# EasyEDA Pro project JLCPRO-PCB-NFC_2023-07-24.epro

# Board PCB-NFC卡片
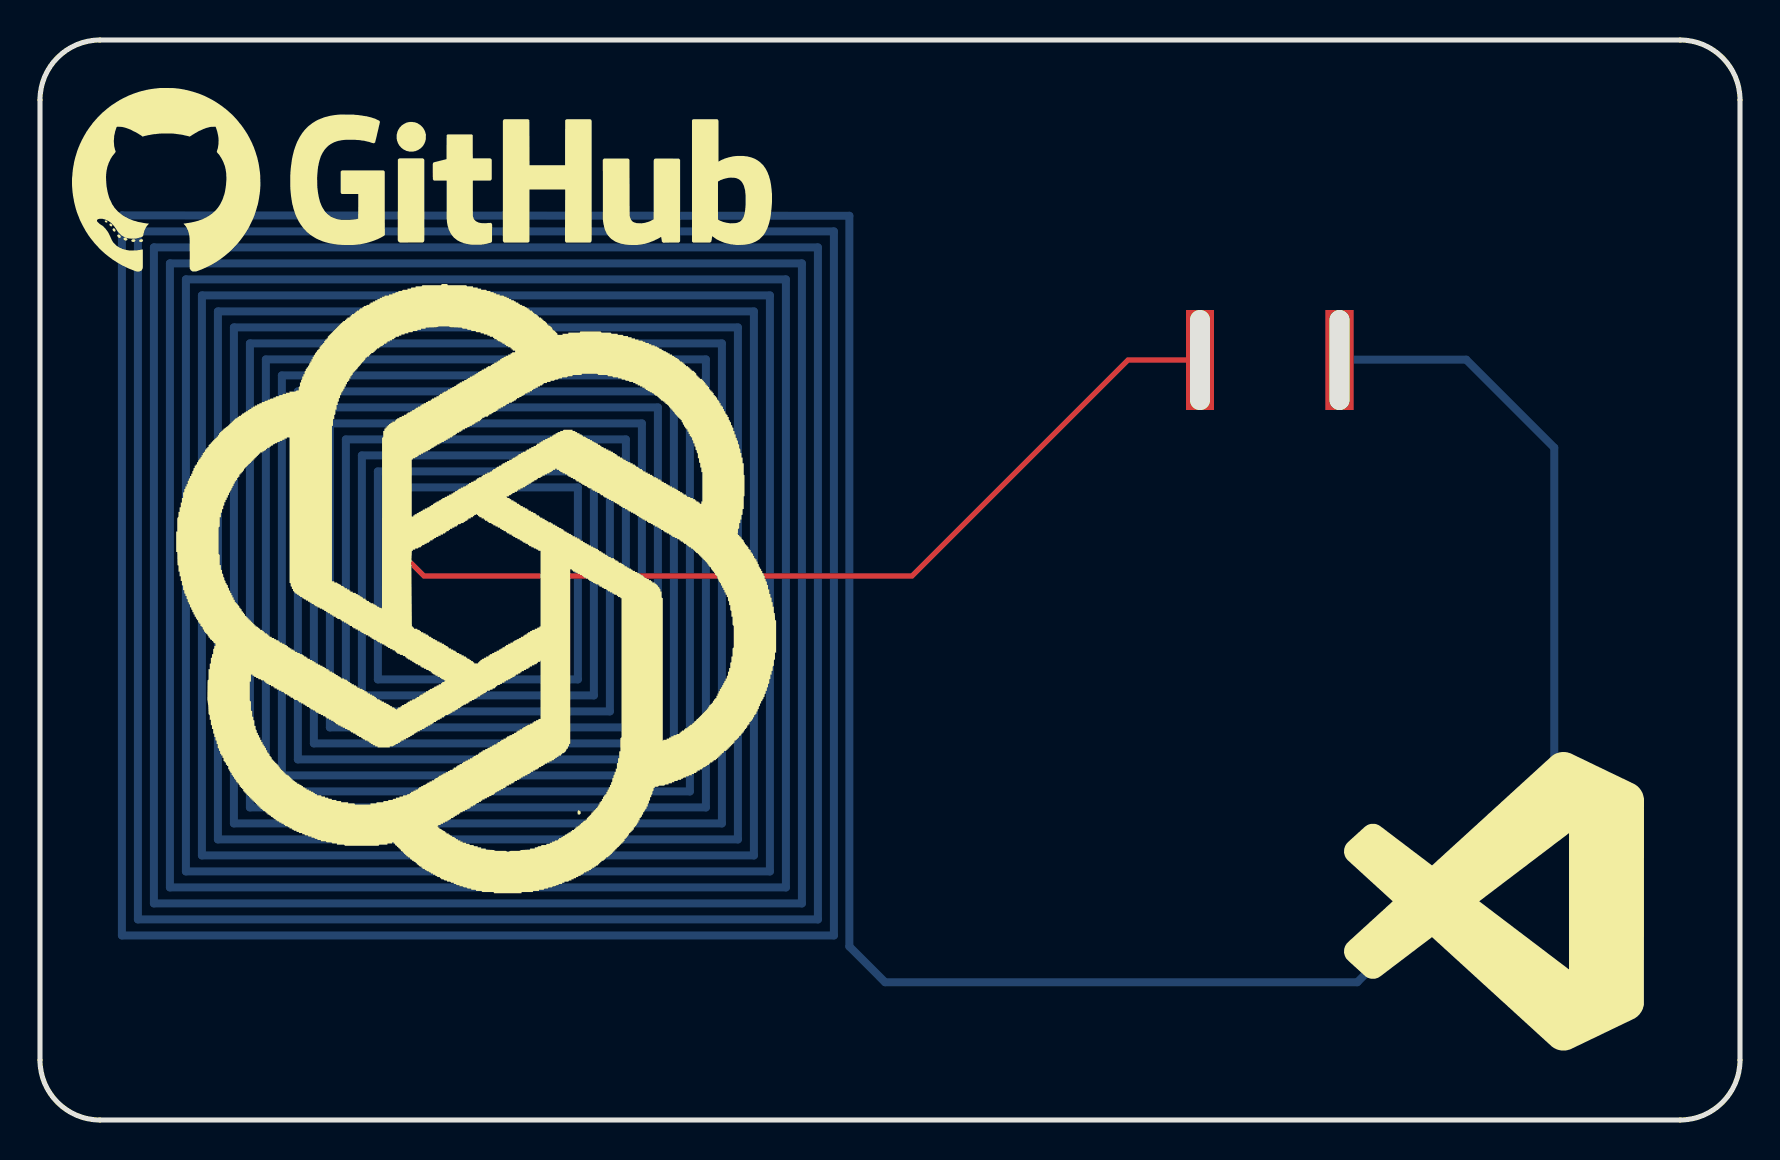
[diagram p0: board, top side]
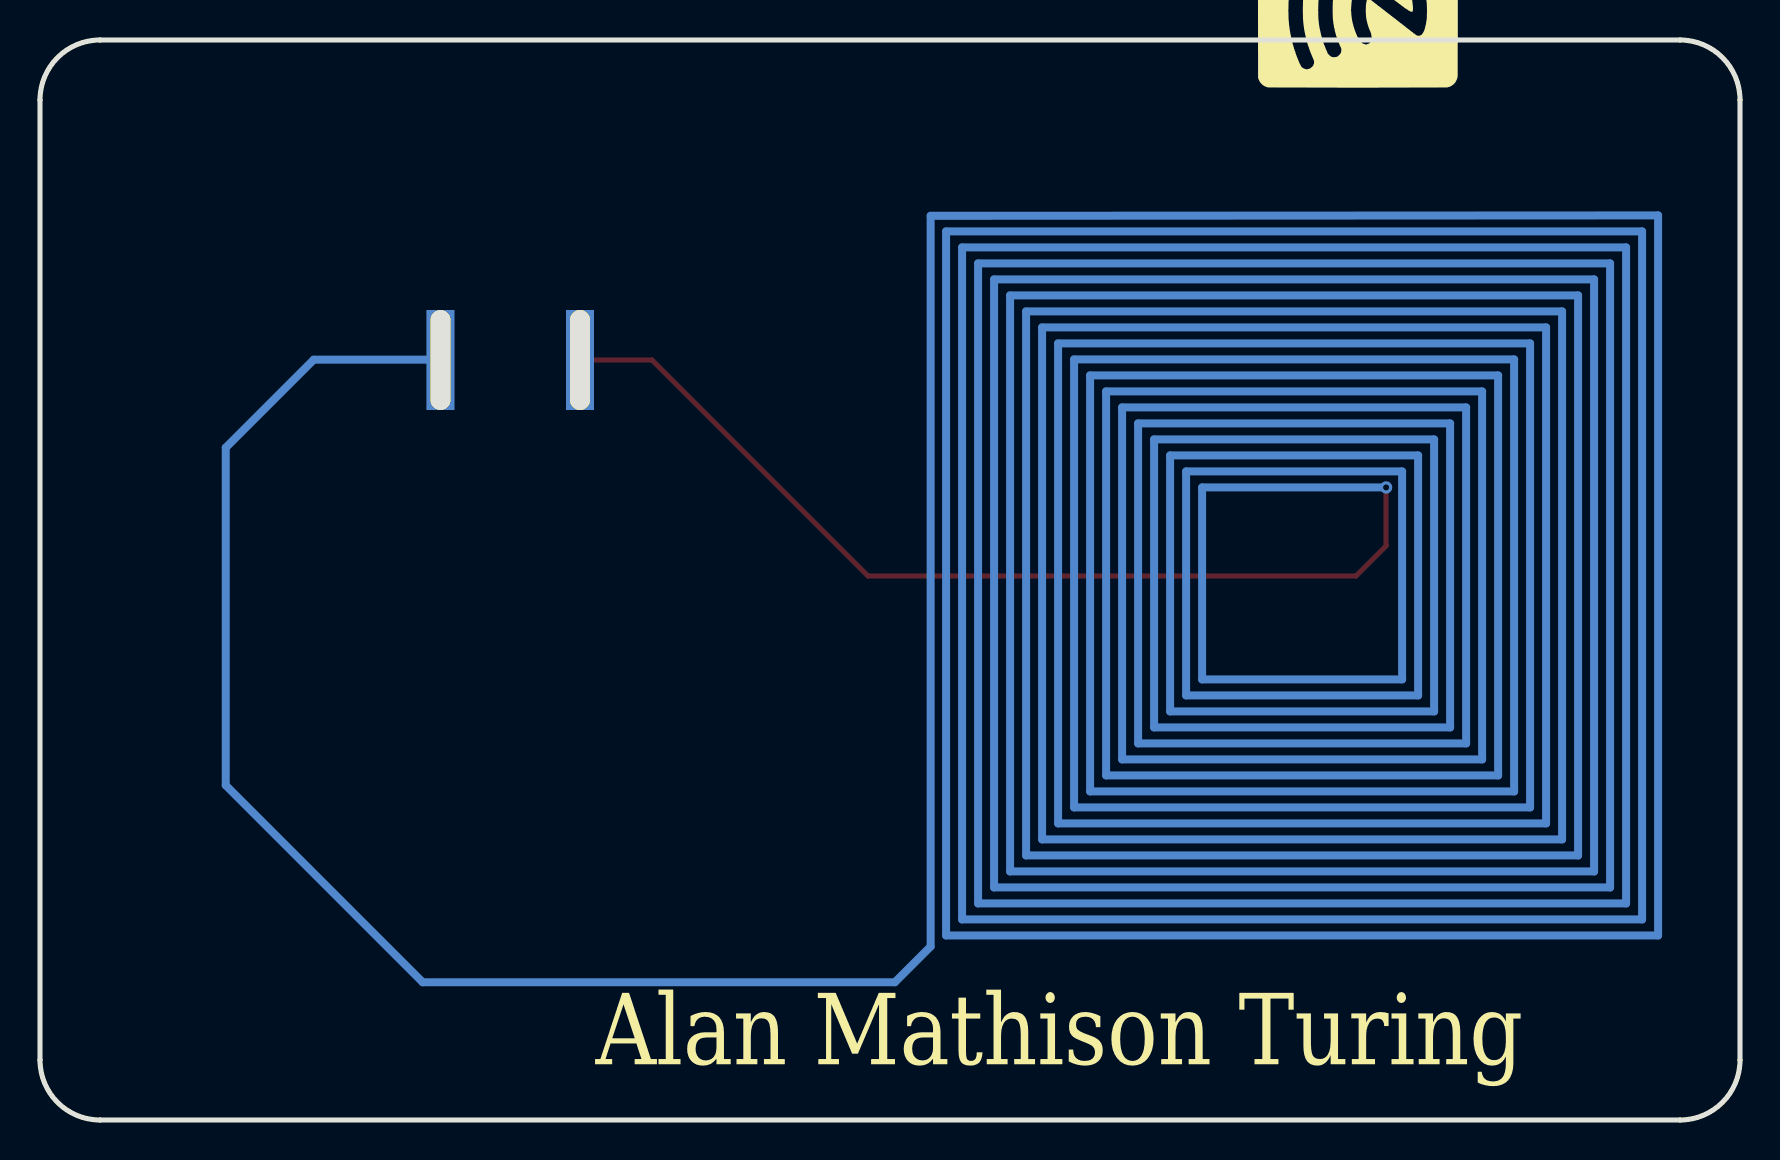
[diagram p1: board, bottom side, seen from below]

Outline 85 x 54 mm; copper layers: Top Layer, Bottom Layer. Coordinates in mm from the lower left corner of the outline.
Outline path: 0,51 0,3 arc(0.88,0.88) 3,0 82,0 arc(84.12,0.88) 85,3 85,51 arc(84.12,53.12) 82,54 3,54 arc(0.88,53.12) 0,51
Stack: Top Layer 0.035mm / Dielectric1 1.51mm FR4 er 4.5 / Bottom Layer 0.035mm

## Design rules (mm)
spacing Default (default): track to track 0.152, other pairs 0 to 0.152
track width Default (default): min 0.254, default 0.254, max 25.4
differential pair differentialPair (default): width min 0.127, default 0.254, max 2.54; gap min 0.152, default 0.152
via Default (default): diameter min 0.61, default 0.61, max 100.025; hole min 0.305, default 0.305, max 59.995

## Placement (name value [footprint] x y rotation side)
NOREF  -  [Pad_e915]  58 38 0 top
NOREF#2  -  [Pad_e916]  64.98 38 0 top

## Footprints (pads in the part's own frame, mm; a bottom-side part is the same pattern mirrored in y, then rotated)
Pad_e915
  rect 1.4x5 hole 1x5: 1(0,0)
Pad_e916
  rect 1.4x5 hole 1x5: 2(0,0)

## Nets
S$39009: NOREF.1 NOREF#2.2

## Via types
v1: diameter 0.61, hole 0.305, Top Layer to Bottom Layer, 1 via

## Routing (per net, layer and track width the routed paths; a pad name or vN(x,y) marks a point on that pad's centre or on a via; arc(x,y) is an arc through that point)
S$39009: length 1727.6
  Top Layer w0.254: v1(17.69,31.63) 17.69,28.71 19.2,27.2 43.6,27.2 54.4,38 NOREF.1
  Bottom Layer w0.4: v1(17.69,31.63) 26.89,31.63 26.89,22.03 16.89,22.03 16.89,32.43 27.69,32.43 27.69,21.23 16.09,21.23 16.09,33.23 28.49,33.23 28.49,20.43 15.29,20.43 15.29,34.03 29.29,34.03 29.29,19.63 14.49,19.63 14.49,34.83 30.09,34.83 30.09,18.83 13.69,18.83 13.69,35.63 30.89,35.63 30.89,18.03 12.89,18.03 12.89,36.43 31.69,36.43 31.69,17.23 12.09,17.23 12.09,37.23 32.49,37.23 32.49,16.43 11.29,16.43 11.29,38.03 33.3,38.03 33.3,15.63 10.5,15.63 10.5,38.83 34.1,38.83 34.1,14.83 9.7,14.83 9.7,39.63 34.89,39.63 34.89,14.03 8.9,14.03 8.9,40.43 35.7,40.43 35.7,13.23 8.1,13.23 8.1,41.23 36.49,41.23 36.49,12.43 7.3,12.43 7.3,42.03 37.3,42.03 37.3,11.63 6.5,11.63 6.5,42.83 38.1,42.83 38.1,10.83 5.7,10.83 5.7,43.63 38.9,43.63 38.9,10.03 4.89,10.03 4.89,44.43 39.7,44.43 39.7,9.23 4.09,9.23 4.09,45.23 40.47,45.21 40.47,8.68 42.26,6.89 65.86,6.89 75.71,16.74 75.71,33.62 71.31,38.02 64.99,38.02 NOREF#2.2

## Text on the board
Bottom Silkscreen Layer: Alan Mathison Turing
